# Altium schematic sheet out.SchDoc
size A; SheetNumber: 1; SheetTotal: 1
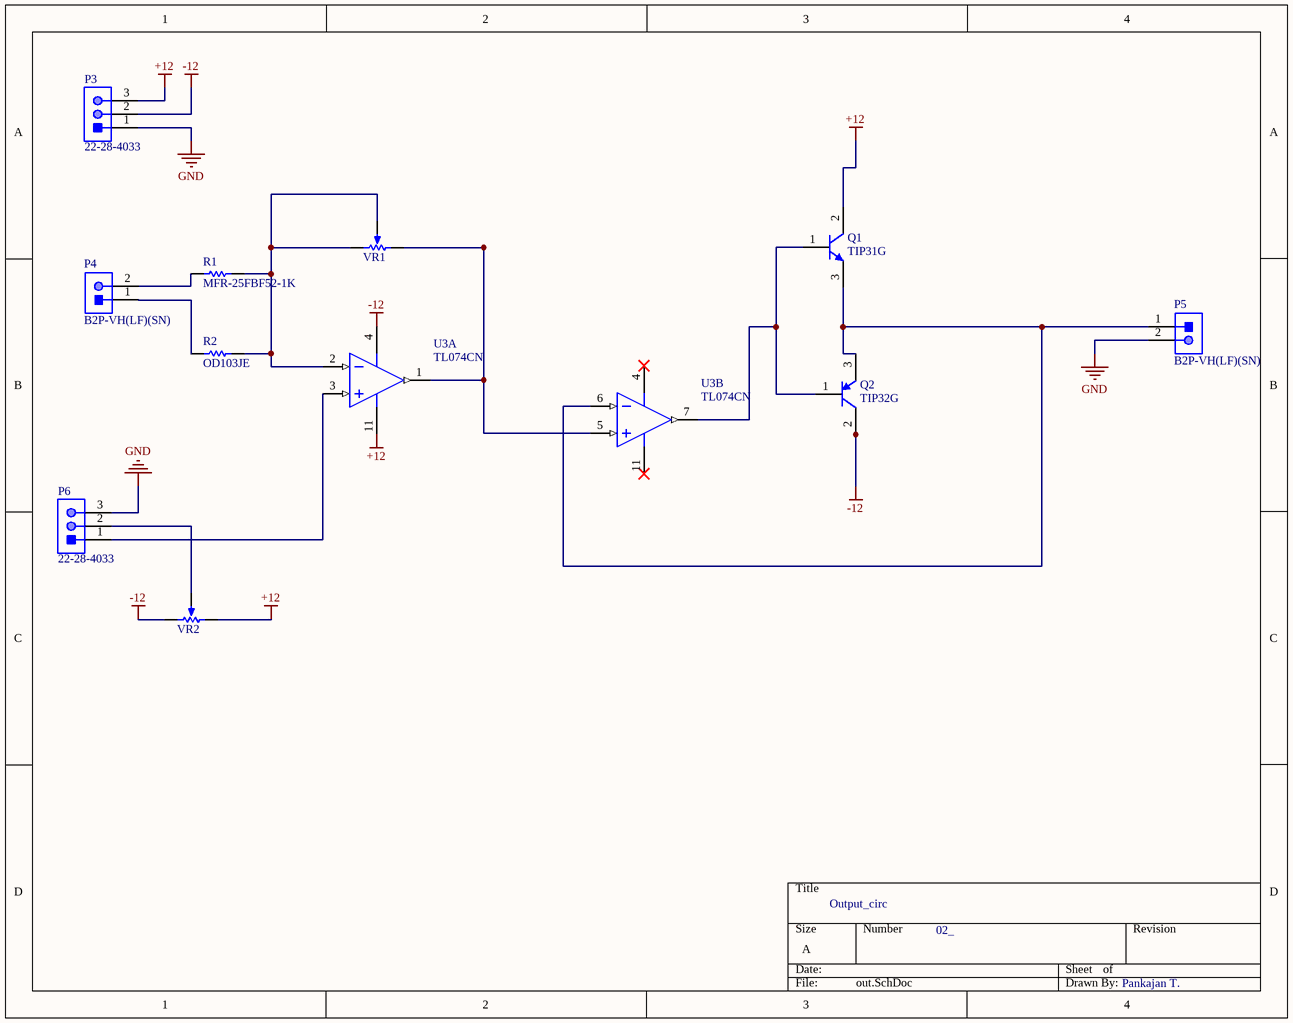
[diagram p0: out.SchDoc]

## Parts
P3  22-28-4033  [MOLX-22-28-4033_V]
P4  B2P-VH(LF)(SN)  [JST-B2P-VH(LF)(SN)_V]
P5  B2P-VH(LF)(SN)  [JST-B2P-VH(LF)(SN)_V]
P6  22-28-4033  [MOLX-22-28-4033_V]
Q1  TIP31G  [ONSC-TO-220-3-221A-09]
Q2  TIP32G  [ONSC-TO-220-3-221A-09]
R1  MFR-25FBF52-1K  [RESA60-630X240]
R2  OD103JE  [OMTE-RES7X2.5-2]
U3  TL074CN  [N0014A]  (parts A,B of 4)
VR1  3362P-1-103LF  [BOUR-3362P]  (value not drawn)
VR2  3362P-1-104LF  [BOUR-3362P]  (value not drawn)

## Nets
+12: P3.3 Q1.2(C) U3.11(VCC-) VR2.1(CCW)
-12: P3.2 Q2.2(C) U3.4(VCC+) VR2.3(CW)
GND: P3.1 P5.2 P6.3
NetP4_2: P4.2 R1.1
NetP5_1: P5.1 Q1.3(E) Q2.3(E) U3.6(IN2-)
NetP6_1: P6.1 U3.3(IN1+)
NetP6_2: P6.2 VR2.2(S)
NetQ1_1: Q1.1(B) Q2.1(B) U3.7(OUT2)
NetR1_2: R1.2 R2.2 U3.2(IN1-) VR1.2(S) VR1.3(CW)
NetU3_1: U3.1(OUT1) U3.5(IN2+) VR1.1(CCW)

Not connected (* = marked no-connect by the designer): P4 1; R2 1

## Notes on the sheet
- Output_circ
- 02_
- Pankajan T.

## Library data of the parts
P3 P6 = CMP-1676-00001-5: Male Header, Pitch 2.54 mm, 1 x 3 Position, Height 8.38 mm, Tail Length 3.18 mm, RoHS, Bulk; Manufacturer: Molex; Rows: 1; Voltage Rating: 250 V; Current Rating: 4 A; Min Operating Temperature: 0 degC; Lead Pitch: 0.1 inch; Packaging: Bulk; Contact Finish: Gold; RoHSCompliant: true; Contact Material: Brass; PackageReference: 22-28-4033; REACH SVHC: Unknown; PackageDescription: Male Header, Pitch 2.54 mm, 1 x 3 Position, Height 8.38 mm, Tail Length 3.18 mm; ComponentLink2URL: http://www.molex.com/pdm_docs/sd/022284033_sd.pdf; Height: 8.38 mm; Mounting Technology: Through Hole; ComponentLink1Description: Manufacturer URL; Length: 7.62 mm; Mount: Through Hole; DatasheetVersion: Rev. G, 01/2012; Max Operating Temperature: 75 degC; ComponentLink2Description: Datasheet; Colour: Black; Pins: 3; Contact Plating: Gold; Package Quantity: 1; ComponentLink1URL: http://www.molex.com/
P4 P5 = CMP-002-00025-2: Male Header, Pitch 3.96 mm, 1 x 2 Position, Height 10.9 mm, Tail Length 3.7 mm, -25 to 85 degC, RoHS, Bulk; Manufacturer: JST; Case/Package: B2P-VH(LF)(SN); Connector Type: Header; Mounting Technology: TH; Package Reference: B2P-VH(LF)(SN); Package Description: Male Header, Pitch 3.96 mm, 1 x 2 Position, Height 10.9 mm, Tail Length 3.7 mm; Max Operating Temperature: 85°C; Manufacturer URL: http://www.jst.com/home2.html; RoHS Compliant: Unknown; Datasheet Version: May-16; Gender: Male; Min Operating Temperature: -25°C; Datasheet URL: http://www.jst-mfg.com/product/pdf/eng/eVH.pdf
Q1 = CMP-1048-01131-1: Complementary Silicon Plastic Power Transistor, 3-Pin TO-220, Pb-Free, Tube; Manufacturer: On Semiconductor; IC Continuous (A): 3; Polarity: NPN; RoHS: TRUE; ComponentLink2Description: Datasheet; ComponentLink3URL: http://www.onsemi.com/pub_link/Collateral/221A-09.PDF; Packing: Tube; fT Min (MHz): 3; PackageReference: TO-220-3-221A-09; Mounting Technology: Through Hole; ComponentLink1Description: Manufacturer URL; ComponentLink1URL: http://www.onsemi.com/; ComponentLink2URL: http://www.onsemi.com/pub_link/Collateral/TIP31A-D.PDF; DatasheetVersion: Rev. 14; PartNumber: TIP31G; ComponentLink3Description: Package Specification; PackageDescription: 3-Pin Flange Mount, Vertical Straight Lead, Body 9.97 x 4.445 mm, Pitch 2.54 mm; PackageVersion: Rev. AG, 09/2011
Q2 = CMP-1048-01078-1: Complementary Silicon Plastic Power Transistor, 3-Pin TO-220, Pb-Free, Tube; Manufacturer: On Semiconductor; Polarity: PNP; IC Continuous (A): 3; DatasheetVersion: Rev. 14; PackageReference: TO-220-3-221A-09; ComponentLink3Description: Package Specification; Packing: Tube; Mounting Technology: Through Hole; ComponentLink1Description: Manufacturer URL; PackageDescription: 3-Pin Flange Mount, Vertical Straight Lead, Body 9.97 x 4.445 mm, Pitch 2.54 mm; ComponentLink2Description: Datasheet; RoHS: TRUE; ComponentLink3URL: http://www.onsemi.com/pub_link/Collateral/221A-09.PDF; PartNumber: TIP32G; ComponentLink1URL: http://www.onsemi.com/; ComponentLink2URL: http://www.onsemi.com/pub_link/Collateral/TIP31A-D.PDF; fT Min (MHz): 3; PackageVersion: Rev. AG, 09/2011
R1 = CMP-1659-00075-1: Axial Resistor, 1 KOhm, +/- 1%, 250 mW, -55 to 155 degC, 2-Pin THD, RoHS, Bulk; Voltage Rating: 250 V; Resistance: 10 kohm; Power Rating: 250 mW; ComponentLink2Description: Datasheet; RoHSCompliant: true; PackageReference: MFR-25; Case\Package: Axial; Max Operating Temperature: 155 degC; DatasheetVersion: Apr-13; Tolerance: 1%; ComponentLink1URL: http://www.yageo.com/; Length: 0.248 inch; ComponentLink2URL: http://www.yageo.com/documents/recent/Yageo%20LR_MFR_2013.pdf; Packaging: Bulk; Package Quantity: 200; PackageDescription: 2-Pin Axial Lead, Dia 2.4 mm, Body Length 6.3 mm; Min Operating Temperature: -55 degC; ComponentLink1Description: Manufacturer URL
R2 = CMP-2000-06865-1: Little Demon(R) Carbon Composition Molded OD Series, 250 V, 10 KOhm, +/-5%, -70 to 130 degC, 2-Pin THD, RoHS, Bulk; Manufacturer: Ohmite; Resistance (Ohms): 10k; Power Rating: 0.25W; Power (Watts): 0.25W,1/4W; Tolerance: ±5%; Online Catalog: OD,OF,OASeries,LittleDemon®; Catalog Drawings: OD,OF,OASeries; EDA / CAD Models: DownloadfromAcceleratedDesigns; Mounting Technology: ThroughHole; Datasheet Version: 06/2016; RoHS Information: LittleDemon"E"SeriesMaterialDeclaration; Number of Terminations: 2; Temperature Coefficient: -; Height: -; Composition: CarbonComposition; Package Description: 2-Pin THD Resistor, Body 7 x 2.5 mm, Lead Dia. 0.6 mm; Size / Dimension: 0.098"Diax0.276"L(2.50mmx7.00mm); Category: Resistors; Manufacturer URL: http://www.ohmite.com/; Features: PulseWithstanding; Family: ThroughHoleResistors; PartNumber: OD103JE; Supplier Device Package: Axial; Package / Case: Axial; Standard Package: 100; Package Reference: RES7X2.5; Operating Temperature: -; Series: LittleDemon®OD; Datasheet URL: http://www.ohmite.com/cat/res_od_of_oa.pdf; Packaging: Bulk
U3 = CMP-0015-00129-2: Quad Low-Noise JFET-Input General-Purpose Operational Amplifier, 7 to 36 V, 0 to 70 degC, 14-pin DIP (N14), Pb-Free (RoHS); Manufacturer: Texas Instruments; Rating: Military; Total Supply Voltage(Max)(+5V is 5, +/-5V is 10): 36; IIB(Max)(pA): 200; Number of Channels: 4; Sub Family: General Purpose Amplifier, High Supply Voltage Amplifier (>=30V); Vio (25C)(Max)(mV): 10; Iq per channel(Max)(mA): 2.5; Total Supply Voltage(Min)(+5V is 5, +/-5V is 10): 7; Vn at 1kHz(Typ)(nV/rtHz): 18; Slew Rate(Typ)(V/us): 13; GBW(Typ)(MHz): 3; CMRR(Min)(dB): 70; DatasheetVersion: SLOS080J; ComponentLink2Description: Datasheet; ComponentLink2URL: http://www.ti.com/lit/ds/symlink/tl074.pdf; ComponentLink3URL: http://www.ti.com/lit/ml/mpdi002c/mpdi002c.pdf; PackageDescription: 14-Pin Plastic In-Line, Body 19.305 x 6.35 mm, Pitch 2.54 mm; Eco-Plan: Pb-Free (RoHS); ComponentLink1Description: Manufacturer URL; PackageReference: N0014A; ComponentLink3Description: Package Specification; Mounting Technology: Through Hole; PackageVersion: 4040049/E, 12/2002; PartNumber: TL074CN; ComponentLink1URL: http://www.ti.com/; Offset Drift(Typ)(uV/C): 18; Code_JEDEC: MS-001
VR1 = CMP-009-00039-2: Square Trimpot(R) Trimming Potentiometer, 10 KOhm, 300 V, -55 to 125 degC, 3-Pin THD, RoHS, Tube; Manufacturer: Bourns; Tolerance: 10%; Power: 500mW; Voltage Rating: 300V; Resistance: 10k; Packaging: Rail/Tube; Package Reference: 3326P; Manufacturer URL: http://www.bourns.com/; Composition: Potentiometer; Package Description: 3-Pin Through Hole Device, Body 6.6 x 6.99 mm, Pitch 2.54 mm; Max Operating Temperature: 125°C; Min Operating Temperature: -55°C; Datasheet Version: May-16; Lead Pitch: 2.54mm; Pins: 3; Datasheet URL: http://www.bourns.com/docs/Product-Datasheets/3362.pdf; Package Quantity: 250; Case/Package: 3326P; RoHS Compliant: True; Mounting Technology: TH
VR2 = CMP-009-00040-2: Square Trimpot(R) Trimming Potentiometer, 100 KOhm, 300 V, -55 to 125 degC, 3-Pin THD, RoHS, Tube; Manufacturer: Bourns; Voltage Rating: 300V; Resistance: 100k; Power: 500mW; Tolerance: 10%; RoHS Compliant: True; Mounting Technology: TH; Datasheet URL: http://www.bourns.com/docs/Product-Datasheets/3362.pdf; Min Operating Temperature: -55°C; Composition: Potentiometer; Package Quantity: 250; Lead Pitch: 2.54mm; Case/Package: 3326P; Package Description: 3-Pin Through Hole Device, Body 6.6 x 6.99 mm, Pitch 2.54 mm; Datasheet Version: May-16; Packaging: Rail/Tube; Package Reference: 3326P; Manufacturer URL: http://www.bourns.com/; Max Operating Temperature: 125°C